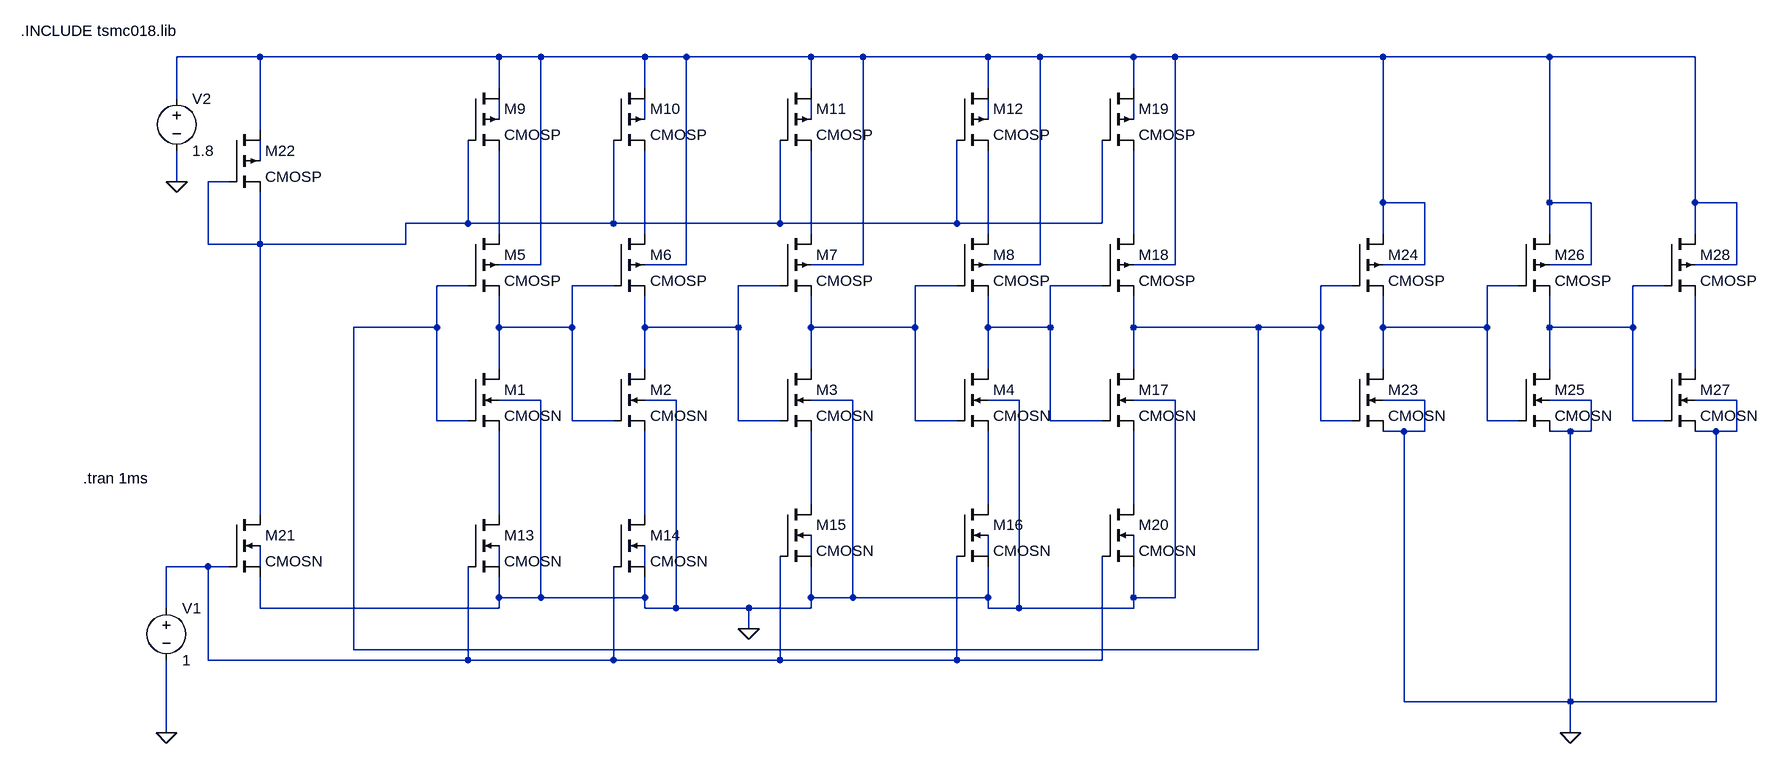
[diagram p0: schematic VCO.asc]
VCO.asc, the LTspice schematic file:
Version 4
SHEET 1 2532 1140
WIRE 256 80 128 80
WIRE 624 80 256 80
WIRE 688 80 624 80
WIRE 848 80 688 80
WIRE 912 80 848 80
WIRE 1104 80 912 80
WIRE 1184 80 1104 80
WIRE 1376 80 1184 80
WIRE 1456 80 1376 80
WIRE 1600 80 1456 80
WIRE 1664 80 1600 80
WIRE 1984 80 1664 80
WIRE 2240 80 1984 80
WIRE 2464 80 2240 80
WIRE 624 128 624 80
WIRE 848 128 848 80
WIRE 1104 128 1104 80
WIRE 1376 128 1376 80
WIRE 1600 128 1600 80
WIRE 128 144 128 80
WIRE 624 176 624 144
WIRE 848 176 848 144
WIRE 1104 176 1104 144
WIRE 1376 176 1376 144
WIRE 1600 176 1600 144
WIRE 256 192 256 80
WIRE 256 240 256 208
WIRE 128 272 128 224
WIRE 208 272 176 272
WIRE 1984 304 1984 80
WIRE 2048 304 1984 304
WIRE 2240 304 2240 80
WIRE 2304 304 2240 304
WIRE 2464 304 2464 80
WIRE 2528 304 2464 304
WIRE 576 336 576 208
WIRE 576 336 480 336
WIRE 800 336 800 208
WIRE 800 336 576 336
WIRE 1056 336 1056 208
WIRE 1056 336 800 336
WIRE 1328 336 1328 208
WIRE 1328 336 1056 336
WIRE 1552 336 1552 208
WIRE 1552 336 1328 336
WIRE 624 352 624 224
WIRE 848 352 848 224
WIRE 1104 352 1104 224
WIRE 1376 352 1376 224
WIRE 1600 352 1600 224
WIRE 1984 352 1984 304
WIRE 2240 352 2240 304
WIRE 2464 352 2464 304
WIRE 176 368 176 272
WIRE 256 368 256 288
WIRE 256 368 176 368
WIRE 480 368 480 336
WIRE 480 368 256 368
WIRE 688 400 688 80
WIRE 688 400 624 400
WIRE 912 400 912 80
WIRE 912 400 848 400
WIRE 1184 400 1184 80
WIRE 1184 400 1104 400
WIRE 1456 400 1456 80
WIRE 1456 400 1376 400
WIRE 1664 400 1664 80
WIRE 1664 400 1600 400
WIRE 2048 400 2048 304
WIRE 2048 400 1984 400
WIRE 2304 400 2304 304
WIRE 2304 400 2240 400
WIRE 2528 400 2528 304
WIRE 2528 400 2464 400
WIRE 576 432 528 432
WIRE 800 432 736 432
WIRE 1056 432 992 432
WIRE 1328 432 1264 432
WIRE 1552 432 1472 432
WIRE 1936 432 1888 432
WIRE 2192 432 2144 432
WIRE 2416 432 2368 432
WIRE 528 496 528 432
WIRE 528 496 400 496
WIRE 624 496 624 448
WIRE 736 496 736 432
WIRE 736 496 624 496
WIRE 848 496 848 448
WIRE 992 496 992 432
WIRE 992 496 848 496
WIRE 1104 496 1104 448
WIRE 1264 496 1264 432
WIRE 1264 496 1104 496
WIRE 1376 496 1376 448
WIRE 1472 496 1472 432
WIRE 1472 496 1376 496
WIRE 1600 496 1600 448
WIRE 1792 496 1600 496
WIRE 1888 496 1888 432
WIRE 1888 496 1792 496
WIRE 1984 496 1984 448
WIRE 2144 496 2144 432
WIRE 2144 496 1984 496
WIRE 2240 496 2240 448
WIRE 2368 496 2368 432
WIRE 2368 496 2240 496
WIRE 624 560 624 496
WIRE 848 560 848 496
WIRE 1104 560 1104 496
WIRE 1376 560 1376 496
WIRE 1600 560 1600 496
WIRE 1984 560 1984 496
WIRE 2240 560 2240 496
WIRE 2464 560 2464 448
WIRE 688 608 624 608
WIRE 896 608 848 608
WIRE 1168 608 1104 608
WIRE 1424 608 1376 608
WIRE 1664 608 1600 608
WIRE 2048 608 1984 608
WIRE 2304 608 2240 608
WIRE 2528 608 2464 608
WIRE 528 640 528 496
WIRE 576 640 528 640
WIRE 736 640 736 496
WIRE 800 640 736 640
WIRE 992 640 992 496
WIRE 1056 640 992 640
WIRE 1264 640 1264 496
WIRE 1328 640 1264 640
WIRE 1472 640 1472 496
WIRE 1552 640 1472 640
WIRE 1888 640 1888 496
WIRE 1936 640 1888 640
WIRE 2144 640 2144 496
WIRE 2192 640 2144 640
WIRE 2368 640 2368 496
WIRE 2416 640 2368 640
WIRE 2016 656 1984 656
WIRE 2048 656 2048 608
WIRE 2048 656 2016 656
WIRE 2272 656 2240 656
WIRE 2304 656 2304 608
WIRE 2304 656 2272 656
WIRE 2496 656 2464 656
WIRE 2528 656 2528 608
WIRE 2528 656 2496 656
WIRE 1104 768 1104 656
WIRE 1376 768 1376 656
WIRE 1600 768 1600 656
WIRE 256 784 256 368
WIRE 624 784 624 656
WIRE 848 784 848 656
WIRE 1104 848 1104 816
WIRE 1376 848 1376 816
WIRE 1600 848 1600 816
WIRE 176 864 112 864
WIRE 208 864 176 864
WIRE 256 864 256 832
WIRE 624 864 624 832
WIRE 848 864 848 832
WIRE 624 912 624 880
WIRE 688 912 688 608
WIRE 688 912 624 912
WIRE 848 912 848 880
WIRE 848 912 688 912
WIRE 1104 912 1104 864
WIRE 1168 912 1168 608
WIRE 1168 912 1104 912
WIRE 1376 912 1376 864
WIRE 1376 912 1168 912
WIRE 1600 912 1600 864
WIRE 1664 912 1664 608
WIRE 1664 912 1600 912
WIRE 112 928 112 864
WIRE 256 928 256 880
WIRE 624 928 624 912
WIRE 624 928 256 928
WIRE 848 928 848 912
WIRE 896 928 896 608
WIRE 896 928 848 928
WIRE 1008 928 896 928
WIRE 1104 928 1104 912
WIRE 1104 928 1008 928
WIRE 1376 928 1376 912
WIRE 1424 928 1424 608
WIRE 1424 928 1376 928
WIRE 1600 928 1600 912
WIRE 1600 928 1424 928
WIRE 1008 960 1008 928
WIRE 400 992 400 496
WIRE 1792 992 1792 496
WIRE 1792 992 400 992
WIRE 176 1008 176 864
WIRE 576 1008 576 864
WIRE 576 1008 176 1008
WIRE 800 1008 800 864
WIRE 800 1008 576 1008
WIRE 1056 1008 1056 848
WIRE 1056 1008 800 1008
WIRE 1328 1008 1328 848
WIRE 1328 1008 1056 1008
WIRE 1552 1008 1552 848
WIRE 1552 1008 1328 1008
WIRE 2016 1072 2016 656
WIRE 2272 1072 2272 656
WIRE 2272 1072 2016 1072
WIRE 2496 1072 2496 656
WIRE 2496 1072 2272 1072
WIRE 112 1120 112 1008
WIRE 2272 1120 2272 1072
FLAG 112 1120 0
FLAG 128 272 0
FLAG 2272 1120 0
FLAG 1008 960 0
DATAFLAG 432 496 ""
DATAFLAG 2016 976 ""
SYMBOL cmosn 576 560 R0
SYMATTR InstName M1
SYMATTR Value2 l=180n w=1u
SYMBOL cmosn 800 560 R0
SYMATTR InstName M2
SYMATTR Value2 l=180n w=1u
SYMBOL cmosn 1056 560 R0
SYMATTR InstName M3
SYMATTR Value2 l=180n w=1u
SYMBOL cmosn 1328 560 R0
SYMATTR InstName M4
SYMBOL cmosp 576 352 R0
SYMATTR InstName M5
SYMATTR Value2 l=180nm w=1um
SYMBOL cmosp 800 352 R0
SYMATTR InstName M6
SYMATTR Value2 l=180n w=1u
SYMBOL cmosp 1056 352 R0
SYMATTR InstName M7
SYMATTR Value2 l=180n w=1u
SYMBOL cmosp 1328 352 R0
SYMATTR InstName M8
SYMATTR Value2 l=180n w=1u
SYMBOL cmosp 576 128 R0
SYMATTR InstName M9
SYMATTR Value2 l=180n w=1u
SYMBOL cmosp 800 128 R0
SYMATTR InstName M10
SYMATTR Value2 l=180n w=1u
SYMBOL cmosp 1056 128 R0
SYMATTR InstName M11
SYMATTR Value2 l=180n w=1u
SYMBOL cmosp 1328 128 R0
SYMATTR InstName M12
SYMATTR Value2 l=180n w=1u
SYMBOL cmosn 576 784 R0
SYMATTR InstName M13
SYMATTR Value2 l=180n w=1u
SYMBOL cmosn 800 784 R0
SYMATTR InstName M14
SYMATTR Value2 l=180n w=1u
SYMBOL cmosn 1056 768 R0
SYMATTR InstName M15
SYMATTR Value2 l=180n w=1u
SYMBOL cmosn 1328 768 R0
SYMATTR InstName M16
SYMATTR Value2 l=180n w=1u
SYMBOL cmosn 1552 560 R0
SYMATTR InstName M17
SYMATTR Value2 l=180n w=1u
SYMBOL cmosp 1552 352 R0
SYMATTR InstName M18
SYMATTR Value2 l=180n w=1u
SYMBOL cmosp 1552 128 R0
SYMATTR InstName M19
SYMATTR Value2 l=180n w=1u
SYMBOL cmosn 1552 768 R0
SYMATTR InstName M20
SYMATTR Value2 l=180n w=1u
SYMBOL voltage 112 912 R0
WINDOW 123 0 0 Left 0
WINDOW 39 0 0 Left 0
SYMATTR InstName V1
SYMATTR Value 1
SYMBOL cmosn 208 784 R0
SYMATTR InstName M21
SYMATTR Value2 l=180n w=1u
SYMBOL cmosp 208 192 R0
SYMATTR InstName M22
SYMATTR Value2 l=180n w=1u
SYMBOL voltage 128 128 R0
WINDOW 123 0 0 Left 0
WINDOW 39 0 0 Left 0
SYMATTR InstName V2
SYMATTR Value 1.8
SYMBOL cmosn 1936 560 R0
SYMATTR InstName M23
SYMATTR Value2 l=180n w=1u
SYMBOL cmosp 1936 352 R0
SYMATTR InstName M24
SYMATTR Value2 l=180n w=1u
SYMBOL cmosn 2192 560 R0
SYMATTR InstName M25
SYMATTR Value2 l=180n w=1u
SYMBOL cmosp 2192 352 R0
SYMATTR InstName M26
SYMATTR Value2 l=180n w=1u
SYMBOL cmosn 2416 560 R0
SYMATTR InstName M27
SYMATTR Value2 l=180n w=1u
SYMBOL cmosp 2416 352 R0
SYMATTR InstName M28
SYMATTR Value2 l=180n w=1u
TEXT -112 40 Left 2 !.INCLUDE tsmc018.lib
TEXT -16 728 Left 2 !.tran 1ms

The netlist it stands for:
* VCO.asc
M1 N015 N014 N025 0 CMOSN l=180n w=1u
M2 N016 N015 N026 0 CMOSN l=180n w=1u
M3 N017 N016 N022 0 CMOSN l=180n w=1u
M4 N018 N017 N023 0 CMOSN
M5 N009 N014 N015 N001 CMOSP l=180nm w=1um
M6 N010 N015 N016 N001 CMOSP l=180n w=1u
M7 N011 N016 N017 N001 CMOSP l=180n w=1u
M8 N012 N017 N018 N001 CMOSP l=180n w=1u
M9 N001 N008 N009 N002 CMOSP l=180n w=1u
M10 N001 N008 N010 N003 CMOSP l=180n w=1u
M11 N001 N008 N011 N004 CMOSP l=180n w=1u
M12 N001 N008 N012 N005 CMOSP l=180n w=1u
M13 N025 N030 0 N032 CMOSN l=180n w=1u
M14 N026 N030 0 N033 CMOSN l=180n w=1u
M15 N022 N030 0 N027 CMOSN l=180n w=1u
M16 N023 N030 0 N028 CMOSN l=180n w=1u
M17 N014 N018 N024 0 CMOSN l=180n w=1u
M18 N013 N018 N014 N001 CMOSP l=180n w=1u
M19 N001 N008 N013 N006 CMOSP l=180n w=1u
M20 N024 N030 0 N029 CMOSN l=180n w=1u
V1 N030 0 1
M21 N008 N030 0 N031 CMOSN l=180n w=1u
M22 N001 N008 N008 N007 CMOSP l=180n w=1u
V2 N001 0 1.8
M23 N019 N014 0 0 CMOSN l=180n w=1u
M24 N001 N014 N019 N001 CMOSP l=180n w=1u
M25 N020 N019 0 0 CMOSN l=180n w=1u
M26 N001 N019 N020 N001 CMOSP l=180n w=1u
M27 N021 N020 0 0 CMOSN l=180n w=1u
M28 N001 N020 N021 N001 CMOSP l=180n w=1u
.model NMOS NMOS
.model PMOS PMOS
.lib standard.mos
.INCLUDE tsmc018.lib
.tran 1ms
.backanno
.end